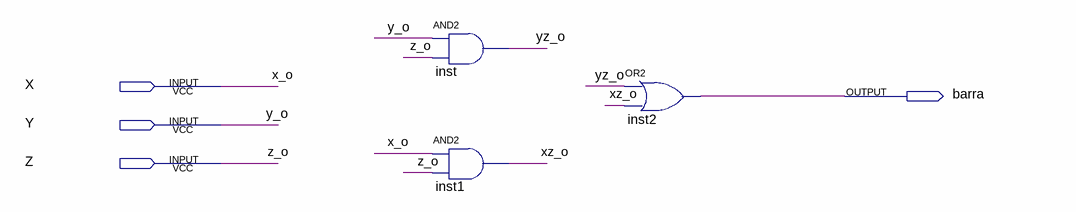
[diagram p0: schematic sheet]
// Quartus schematic barra_maior_que_dez.bdf as structural Verilog: 3 symbols, 4 pins
module barra_maior_que_dez (
  input  X,
  input  Y,
  input  Z,
  output barra
);

  wire xz_o, yz_o;

  and inst (yz_o, Y, Z);
  and inst1 (xz_o, X, Z);
  or inst2 (barra, yz_o, xz_o);

  // Other names for the same wires on the sheet: x_o = X; y_o = Y; z_o = Z
endmodule
